# Altium schematic sheet dep-switches.SchDoc
size A4
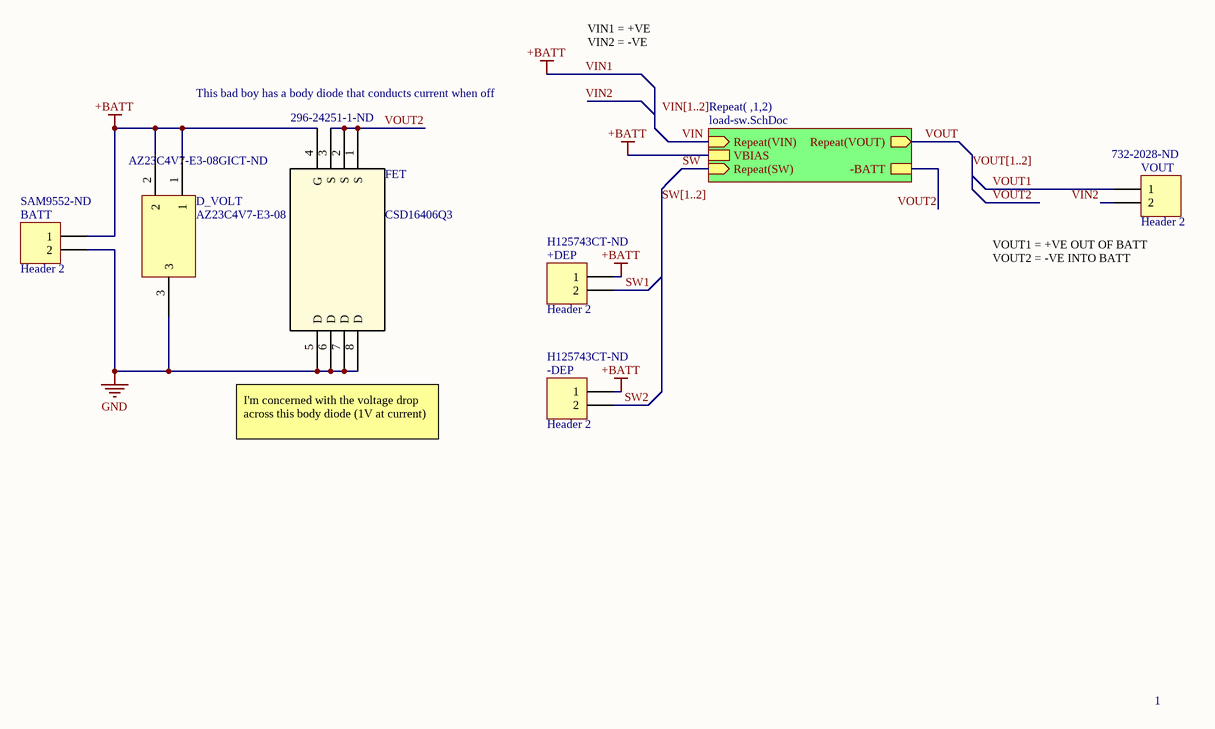
[diagram p0: dep-switches.SchDoc]

## Parts
+DEP  Header 2  Supplier Part Number 1: H125743CT-ND  [DF13A-2P-1.25H(21)]
-DEP  Header 2  Supplier Part Number 1: H125743CT-ND  [DF13A-2P-1.25H(21)]
BATT  Header 2  [SAM9552-ND]
D_VOLT  AZ23C4V7-E3-08  Supplier Part Number 1: AZ23C4V7-E3-08GICT-ND
FET  CSD16406Q3  Supplier Part Number 1: 296-24251-1-ND  [CSD16406Q3]
VOUT  Header 2  Supplier Part Number 1: 732-2028-ND  [CON2_SCREW_5.00MM_691102710002]

## Sub-sheets
Repeat( ,1,2) = load-sw.SchDoc: Repeat(SW) (in), Repeat(VIN) (in), -BATT, Repeat(VOUT) (out), VBIAS

## Nets
GND: BATT.2 D_VOLT.3 FET.5(D) FET.6(D) FET.7(D) FET.8(D)
VIN1: +DEP.1 -DEP.1 BATT.1 D_VOLT.1 D_VOLT.2 FET.4(G) ; sheet Repeat( ,1,2)/VBIAS  [also labelled +BATT]
SW: sheet Repeat( ,1,2)/Repeat(SW)
SW1: +DEP.2
SW2: -DEP.2
VIN: sheet Repeat( ,1,2)/Repeat(VIN)
VIN2: VOUT.2
VOUT: sheet Repeat( ,1,2)/Repeat(VOUT)
VOUT1: VOUT.1
VOUT2: FET.1(S) FET.2(S) FET.3(S) ; sheet Repeat( ,1,2)/-BATT

## Buses and harness runs
bus SW[1..2]
bus VIN[1..2]
bus VOUT[1..2]

## Notes on the sheet
- This bad boy has a body diode that conducts current when off
- VIN1 = +VE
  VIN2 = -VE
- (near VOUT) VOUT1 = +VE OUT OF BATT
  VOUT2 = -VE INTO BATT
- I'm concerned with the voltage drop across this body diode (1V at current)
- 1
- Labels drawn without touching a wire or pin: VIN[1..2]

## Library data of the parts
+DEP -DEP = Header 2: Header, 2-Pin; Manufacturer: Hirose; Number of Positions: 2; Pitch: 1.25mm; LatestRevisionDate: 17-Jul-2002; LatestRevisionNote: Re-released for DXP Platform.; Publisher: Altium Limited; Supplier 1: Digi-Key; Manufacturer Part Number: DF13A-2P-1.25H(21); Stock 1: 4810; Pricing 1: 1=0.43, 10=0.403, 100=0.3087, 500=0.2684 (USD); Contact Material: Brass; Housing Material: Polyamide; Contact Gender: Male; Package Quantity: 1000; Number of Rows: 1; Packaging: Tape and Reel; Termination: SMD/SMT; Lead Free: Lead Free
BATT = Header 2: Header, 2-Pin; Manufacturer: Samtec; Manufacturer Part Number: IPBT-102-H1-T-S-RA-K; Number of Contacts: 2; Gender: Male; Pitch: 4.19mm; LatestRevisionDate: 17-Jul-2002; LatestRevisionNote: Re-released for DXP Platform.; Publisher: Altium Limited; Supplier 1: Digi-Key; Supplier Part Number 1: SAM9552-ND; Stock 1: 4351; Pricing 1: 1=1.39, 57=1.13298, 114=1.08149, 513=0.90125, 1026=0.7725, 5016=0.68495, 10032=0.6695 (USD); Mount: Through Hole; Packaging: Rail/Tube; Termination: Solder; Orientation: Right Angle; Radiation Hardening: No; ComponentLink1URL: http://www.samtec.com/documents/webfiles/pdf/ipbt.pdf?src-supplier=Avnet; ComponentLink1Description: http://www.samtec.com/documents/webfiles/pdf/ipbt.pdf?src-supplier=Avnet
D_VOLT = AZ23C4V7-E3-08: 300mW zener diode; Manufacturer: Vishay; Element Configuration: Common Anode; Zener Voltage: 4.7V; Impedance: 78R; Voltage Tolerance: 5%; Supplier 1: Digi-Key; Manufacturer Part Number: AZ23C4V7-E3-08; Stock 1: 7800; Pricing 1: 1=0.31, 10=0.255, 25=0.2132, 100=0.135, 250=0.10424, 500=0.08884, 1000=0.06041 (USD); Mount: Surface Mount; Case/Package: SOT-23; Number of Pins: 3; Weight: 0.00031oz; Min Operating Temperature: -55°C; Max Operating Temperature: 150°C; Packaging: Tape and Reel; Package Quantity: 3000; Max Power Dissipation: 300mW; Power Dissipation: 300mW; Tolerance: 5%; REACH SVHC: Unknown
FET = CSD16406Q3: Power MOSFET; Manufacturer: Texas Instruments; Rise Time: 12.9ns; Rds On Max: 5.3mR; Input Capacitance: 1.1nF; Nominal Vgs: 1.7V; Dual Supply Voltage: 25V; Continuous Drain Current (ID): 60A; Max Power Dissipation: 2.7W; Fall Time: 4.8ns; Turn-Off Delay Time: 8.5ns; Gate to Source Voltage (Vgs): 16V; Turn-On Delay Time: 7.3ns; Number of Elements: 1; Element Configuration: Single; Supplier 1: Digi-Key; Manufacturer Part Number: CSD16406Q3; Stock 1: 25901; Pricing 1: 1=1.16, 10=1.031, 100=0.8151, 500=0.63212, 1000=0.49904 (USD); Mount: Surface Mount; Case/Package: QFN; Number of Pins: 8; Contact Plating: Tin,Matte; Min Operating Temperature: -55°C; Max Operating Temperature: 150°C; Packaging: Tape and Reel; Package Quantity: 1; Drain to Source Voltage (Vdss): 25V; Drain to Source Breakdown Voltage: 25V; Power Dissipation: 2.7W; Termination: SMD/SMT; Threshold Voltage: 1.7V; Radiation Hardening: No; REACH SVHC: No SVHC; Lead Free: Contains Lead; ComponentLink1URL: http://www.ti.com/general/docs/lit/getliterature.tsp?genericPartNumber=CSD16406Q3&&fileType=pdf&src-supplier=Avnet; ComponentLink1Description: http://www.ti.com/general/docs/lit/getliterature.tsp?genericPartNumber=CSD16406Q3&&fileType=pdf&src-supplier=Avnet; ComponentLink2URL: http://www.ti.com/lit/ds/symlink/csd16406q3.pdf?src-supplier=Digi-Key; ComponentLink2Description: http://www.ti.com/lit/ds/symlink/csd16406q3.pdf?src-supplier=Digi-Key; ComponentLink3URL: http://www.mouser.com/ds/2/405/slps202a-128073.pdf?src-supplier=Mouser; ComponentLink3Description: http://www.mouser.com/ds/2/405/slps202a-128073.pdf?src-supplier=Mouser; ComponentLink4URL: http://www.farnell.com/datasheets/483980.pdf?src-supplier=Farnell; ComponentLink4Description: http://www.farnell.com/datasheets/483980.pdf?src-supplier=Farnell; ComponentLink5URL: http://www.ti.com/general/docs/lit/getliterature.tsp?genericPartNumber=CSD16406Q3&amp;&amp;fileType=pdf&src-supplier=Farnell; ComponentLink5Description: http://www.ti.com/general/docs/lit/getliterature.tsp?genericPartNumber=CSD16406Q3&amp;&amp;fileType=pdf&src-supplier=Farnell; ComponentLink6URL: http://www.farnell.com/simulation/1744921.zip?src-supplier=Element14; ComponentLink6Description: http://www.farnell.com/simulation/1744921.zip?src-supplier=Element14
VOUT = Header 2: Header, 2-Pin; Manufacturer: Wurth Electronics; Manufacturer Part Number: 691102710002; Plating: Steel; Voltage Rating: 300V; Current Rating: 15A; Number of Levels: 1; Number of Positions Per Level: 2; Wire/Cable Gauge: 22AWG; Wire Gauge (Min): 14AWG; Pitch: 0.197inch; Stripping Length: -6mm; LatestRevisionDate: 17-Jul-2002; LatestRevisionNote: Re-released for DXP Platform.; Publisher: Altium Limited; Supplier 1: Digi-Key; Stock 1: 735; Pricing 1: 1=0.69, 10=0.616, 50=0.532, 100=0.5 (USD); Mount: Through Hole; Contact Material: Brass; Color: Blue; Contact Plating: Tin; Housing Material: Nylon; Min Operating Temperature: -40°C; Max Operating Temperature: 105°C; Package Quantity: 900; Packaging: Bulk; Current: 15A; Voltage: 300V; Termination: Screw; Number of Contacts: 2; Length: 7.5mm; Height: 13.4mm; Width: 11.2mm; Wire Gauge (Max): 22AWG; REACH SVHC: Unknown; ComponentLink1URL: https://katalog.we-online.de/em/datasheet/6911027100xx.pdf?src-supplier=Digi-Key; ComponentLink1Description: https://katalog.we-online.de/em/datasheet/6911027100xx.pdf?src-supplier=Digi-Key; ComponentLink2URL: http://www.produktinfo.conrad.com/datenblaetter/1000000-1099999/001088592-da-01-en-WR_TBL_TERMINAL_BLOCK102_691102710002.pdf?src-supplier=Conrad; ComponentLink2Description: http://www.produktinfo.conrad.com/datenblaetter/1000000-1099999/001088592-da-01-en-WR_TBL_TERMINAL_BLOCK102_691102710002.pdf?src-supplier=Conrad